# EAGLE schematic tarjeta_dspic33_proto_rev2 (EAGLE 4.16)

## Sheet 1 of 7
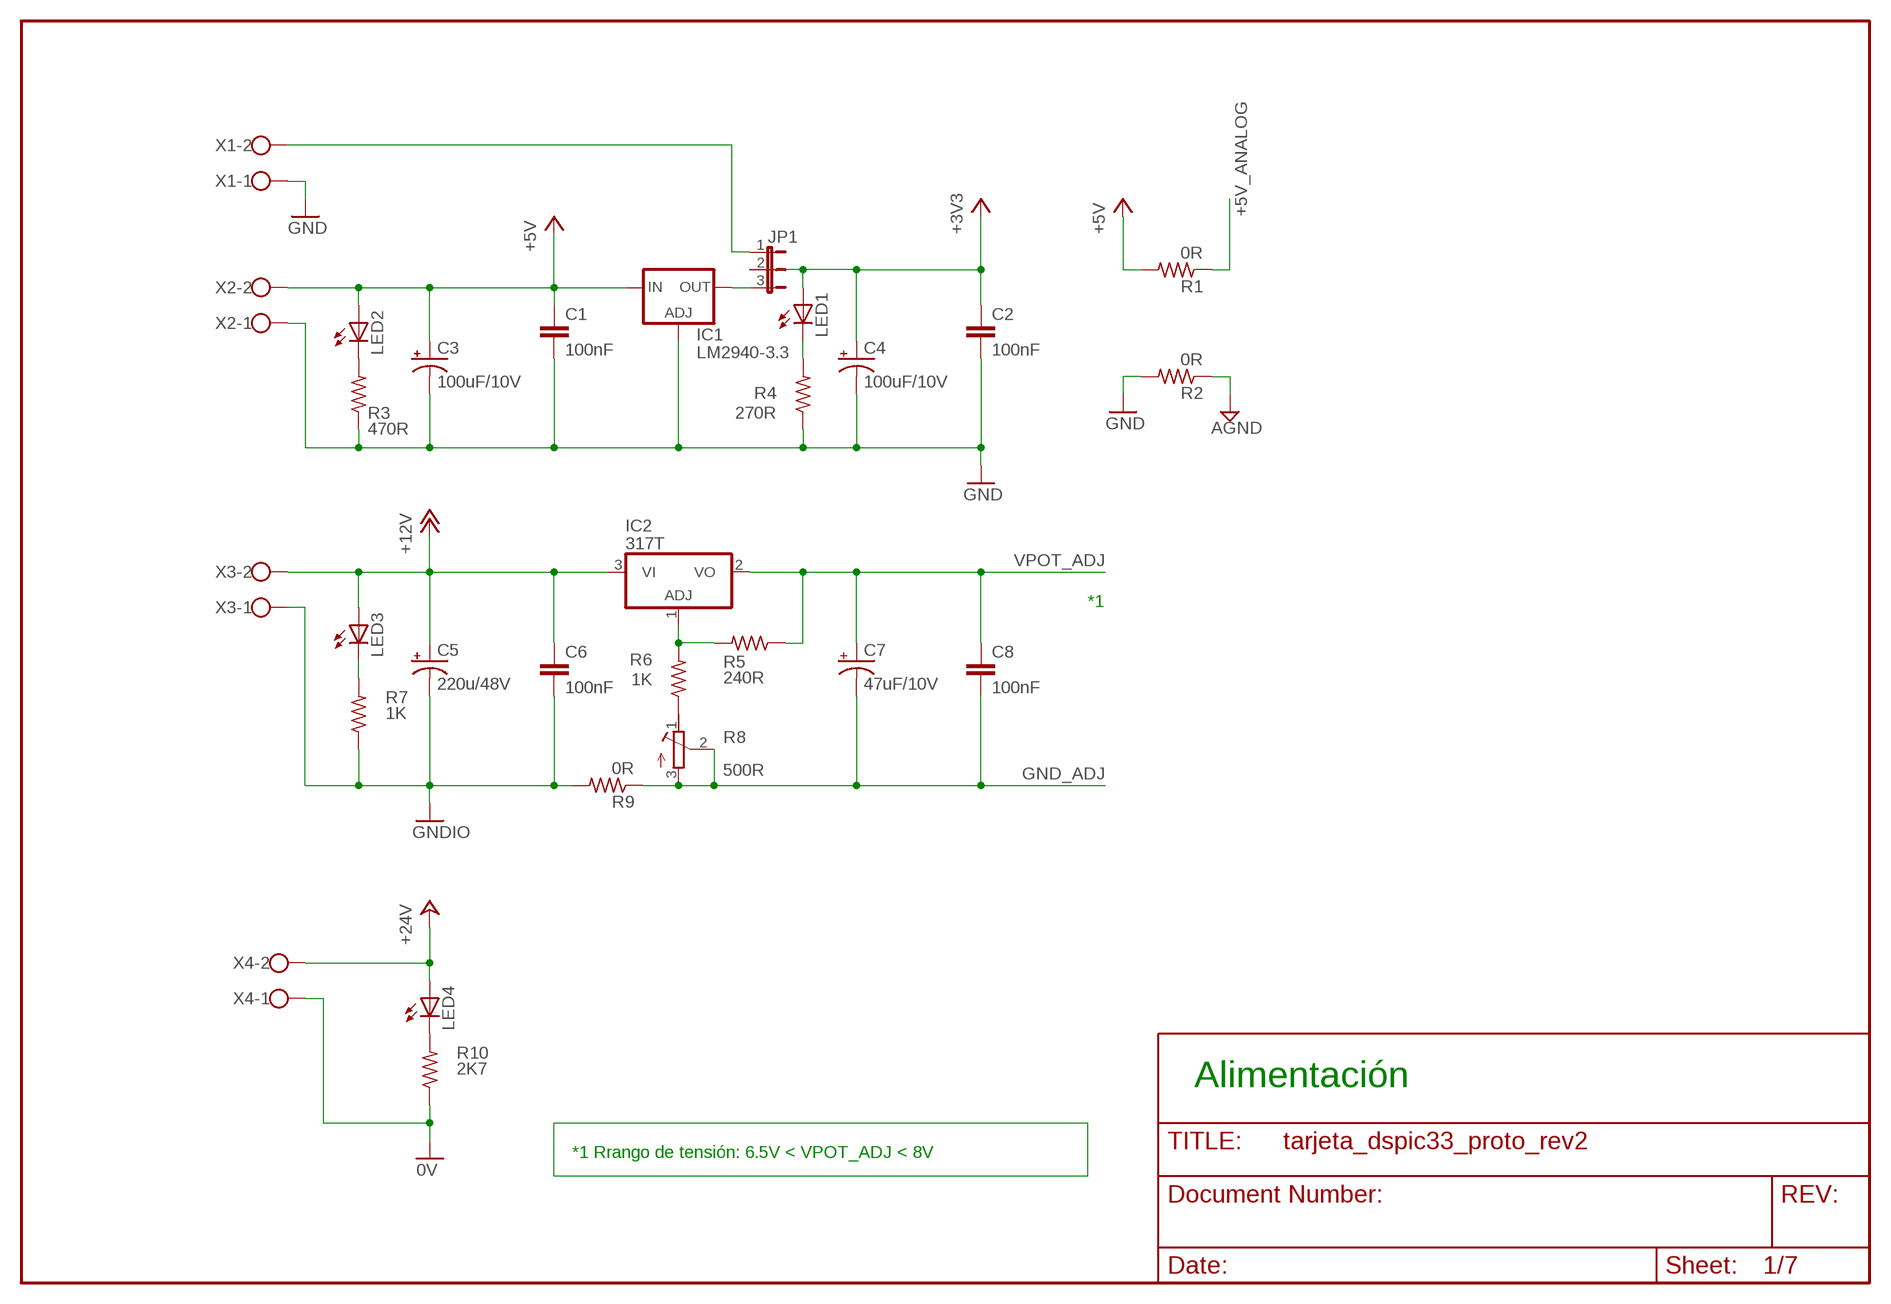
[diagram p0: schematic, sheet 1]

### Parts
C1  100nF  C-EU050-024X044  [C050-024X044]
C2  100nF  C-EU050-024X044  [C050-024X044]
C3  100uF/10V  CPOL-USE2-5  [E2-5]
C4  100uF/10V  CPOL-USE2-5  [E2-5]
C5  220u/48V  CPOL-USE2-5  [E2-5]
C6  100nF  C-EU050-024X044  [C050-024X044]
C7  47uF/10V  CPOL-USE2-5  [E2-5]
C8  100nF  C-EU050-024X044  [C050-024X044]
IC1  LM2940-3.3  LM317MABT  [TO220L1]
IC2  317T  [TO220H]
JP1  JP2E  [JP2]
LED1  LED3MM  [LED3MM]
LED2  LED3MM  [LED3MM]
LED3  LED3MM  [LED3MM]
LED4  LED3MM  [LED3MM]
R1  0R  R-US_0309/10  [0309/10]
R2  0R  R-US_0309/10  [0309/10]
R3  470R  R-US_0309/10  [0309/10]
R4  270R  R-US_0309/10  [0309/10]
R5  240R  R-US_0309/10  [0309/10]
R6  1K  R-US_0309/10  [0309/10]
R7  1K  R-US_0309/10  [0309/10]
R8  500R  R-TRIMMT93YA  [RTRIMT93YA]
R9  0R  R-US_0309/10  [0309/10]
R10  2K7  R-US_0309/10  [0309/10]
X1  W237-02P  [W237-132]
X2  W237-02P  [W237-132]
X3  W237-02P  [W237-132]
X4  W237-02P  [W237-132]

### Nets
0V: R10.1 X4.1 ; also sheet 2
+3V3: C2.1 C4.+ JP1.2 LED1.A ; also sheet 4,6,7
+5V: C1.1 C3.+ IC1.3(IN) LED2.A R1.2 X2.2 ; also sheet 2,3,4
+5V_ANALOG: R1.1 ; also sheet 2,5,7
+12V: C5.+ C6.1 IC2.3(VI) LED3.A X3.2 ; also sheet 3,4,5
+24V: LED4.A X4.2 ; also sheet 2
AGND: R2.1 ; also sheet 2,5,7
GND: C1.2 C2.2 C3.- C4.- IC1.1(ADJ) R2.2 R3.1 R4.1 X1.1 X2.1 ; also sheet 2,3,4,6,7
GND_ADJ: C7.- C8.2 R8.2(S) R8.3(E) R9.1 ; also sheet 3
GNDIO: C5.- C6.2 R7.1 R9.2 X3.1 ; also sheet 3,4,5
N$3: IC1.2(OUT) JP1.3
N$12: JP1.1 X1.2
N$17: R6.1 R8.1(A)
N$24: IC2.1(ADJ) R5.2 R6.2
N$64: LED2.K(C) R3.2
N$65: LED1.K(C) R4.2
N$66: LED3.K(C) R7.2
N$67: LED4.K(C) R10.2
VPOT_ADJ: C7.+ C8.1 IC2.2(VO) R5.1 ; also sheet 3

### Notes on the sheet
- *1
- Alimentación
- *1 Rrango de tensión: 6.5V < VPOT_ADJ < 8V

## Sheet 2 of 7
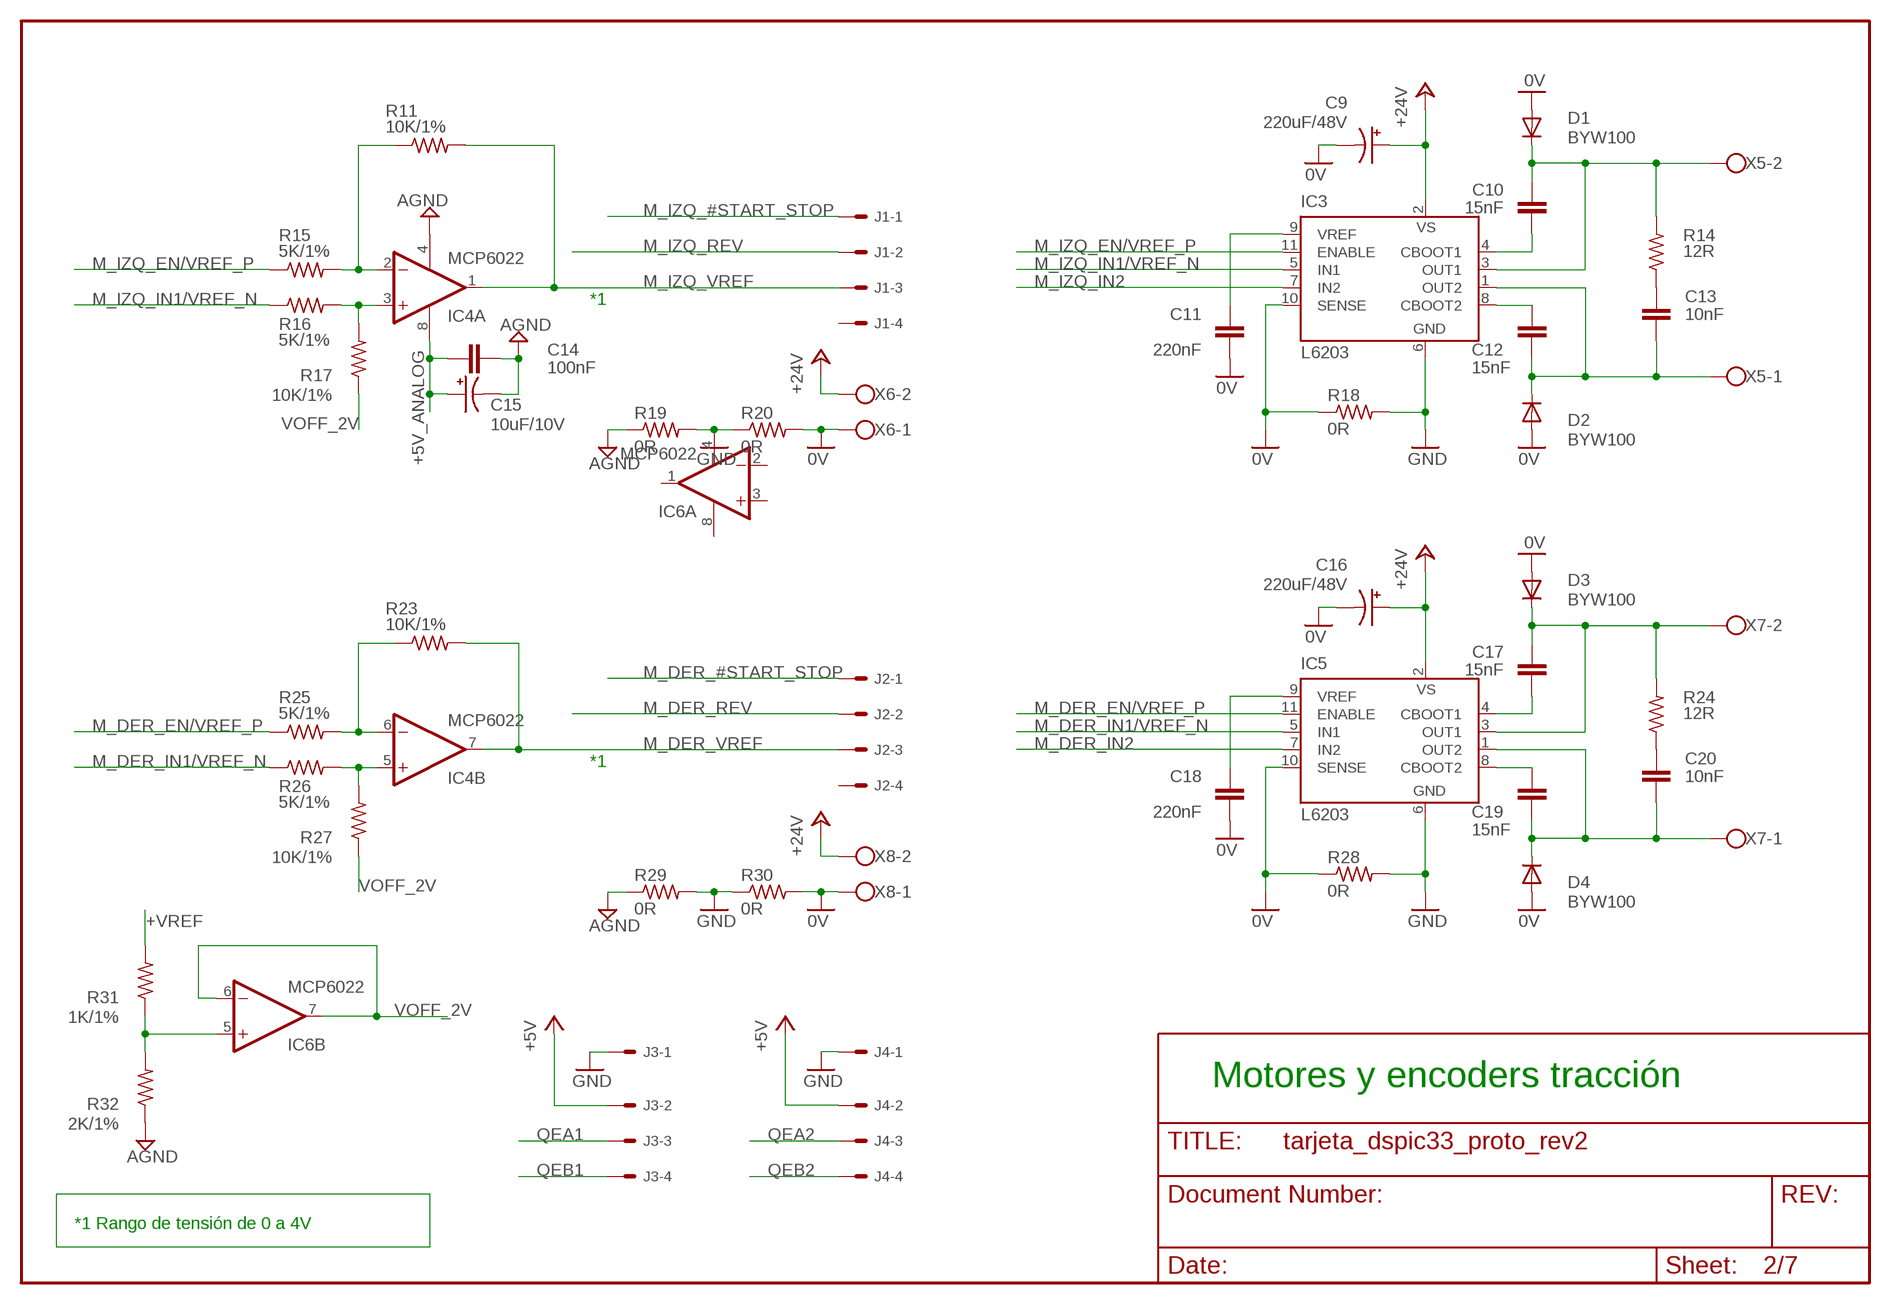
[diagram p1: schematic, sheet 2]

### Parts
C9  220uF/48V  CPOL-USE3.5-10  [E3,5-10]
C10  15nF  C-EU050-024X044  [C050-024X044]
C11  220nF  C-EU050-024X044  [C050-024X044]
C12  15nF  C-EU050-024X044  [C050-024X044]
C13  10nF  C-EU050-024X044  [C050-024X044]
C14  100nF  C-EU050-024X044  [C050-024X044]
C15  10uF/10V  CPOL-USE3.5-10  [E3,5-10]
C16  220uF/48V  CPOL-USE3.5-10  [E3,5-10]
C17  15nF  C-EU050-024X044  [C050-024X044]
C18  220nF  C-EU050-024X044  [C050-024X044]
C19  15nF  C-EU050-024X044  [C050-024X044]
C20  10nF  C-EU050-024X044  [C050-024X044]
D1  BYW100  [F126-10]
D2  BYW100  [F126-10]
D3  BYW100  [F126-10]
D4  BYW100  [F126-10]
IC3  L6203  [MULTIWATT-11]
IC4  MCP6022  OPA2344P  [DIL08]
IC5  L6203  [MULTIWATT-11]
IC6  MCP6022  OPA2344P  [DIL08]
J1  22-27-2041-04  [6410-04]
J2  22-27-2041-04  [6410-04]
J3  22-27-2041-04  [6410-04]
J4  22-27-2041-04  [6410-04]
R11  10K/1%  R-US_0309/10  [0309/10]
R14  12R  R-US_0309/10  [0309/10]
R15  5K/1%  R-US_0309/10  [0309/10]
R16  5K/1%  R-US_0309/10  [0309/10]
R17  10K/1%  R-US_0309/10  [0309/10]
R18  0R  R-US_0309/10  [0309/10]
R19  0R  R-US_0309/10  [0309/10]
R20  0R  R-US_0309/10  [0309/10]
R23  10K/1%  R-US_0309/10  [0309/10]
R24  12R  R-US_0309/10  [0309/10]
R25  5K/1%  R-US_0309/10  [0309/10]
R26  5K/1%  R-US_0309/10  [0309/10]
R27  10K/1%  R-US_0309/10  [0309/10]
R28  0R  R-US_0309/10  [0309/10]
R29  0R  R-US_0309/10  [0309/10]
R30  0R  R-US_0309/10  [0309/10]
R31  1K/1%  R-US_0309/10  [0309/10]
R32  2K/1%  R-US_0309/10  [0309/10]
X5  W237-02P  [W237-132]
X6  W237-02P  [W237-132]
X7  W237-02P  [W237-132]
X8  W237-02P  [W237-132]

### Nets
0V: C9.- C11.2 C16.- C18.2 D1.A D2.A D3.A D4.A IC3.10(SENSE) IC5.10(SENSE) R18.1 R20.2 R28.1 R30.2 X6.1 X8.1 ; also sheet 1
+5V: J3.2 J4.2 ; also sheet 1,3,4
+5V_ANALOG: C14.1 C15.+ IC4.8(A:V+) ; also sheet 1,5,7
+24V: C9.+ C16.+ IC3.2(VS) IC5.2(VS) X6.2 X8.2 ; also sheet 1
+VREF: R31.2 ; also sheet 5,7
AGND: C14.2 C15.- IC4.4(A:V-) R19.1 R29.1 R32.1 ; also sheet 1,5,7
GND: IC3.6(GND) IC5.6(GND) J3.1 J4.1 R18.2 R19.2 R20.1 R28.2 R29.2 R30.1 ; also sheet 1,3,4,6,7
M_DER_#START_STOP: J2.1 ; also sheet 7
M_DER_EN/VREF_P: IC5.11(ENABLE) R25.1 ; also sheet 7
M_DER_IN1/VREF_N: IC5.5(IN1) R26.1 ; also sheet 7
M_DER_IN2: IC5.7(IN2) ; also sheet 7
M_DER_REV: J2.2 ; also sheet 7
M_DER_VREF: IC4.7(B:OUT) J2.3 R23.2
M_IZQ_#START_STOP: J1.1 ; also sheet 7
M_IZQ_EN/VREF_P: IC3.11(ENABLE) R15.1 ; also sheet 7
M_IZQ_IN1/VREF_N: IC3.5(IN1) R16.1 ; also sheet 7
M_IZQ_IN2: IC3.7(IN2) ; also sheet 7
M_IZQ_REV: J1.2 ; also sheet 7
M_IZQ_VREF: IC4.1(A:OUT) J1.3 R11.2
N$4: C11.1 IC3.9(VREF)
N$6: IC6.5(B:+IN) R31.1 R32.2
N$7: C12.1 IC3.8(CBOOT2)
N$8: C10.1 IC3.4(CBOOT1)
N$9: C10.2 D1.C IC3.3(OUT1) R14.2 X5.2
N$10: C13.2 R14.1
N$11: C12.2 C13.1 D2.C IC3.1(OUT2) X5.1
N$14: IC4.2(A:-IN) R11.1 R15.2
N$15: C18.1 IC5.9(VREF)
N$18: C19.1 IC5.8(CBOOT2)
N$19: C17.1 IC5.4(CBOOT1)
N$20: C20.2 R24.1
N$21: C17.2 D3.C IC5.3(OUT1) R24.2 X7.2
N$22: C19.2 C20.1 D4.C IC5.1(OUT2) X7.1
N$25: IC4.3(A:+IN) R16.2 R17.2
N$28: IC4.6(B:-IN) R23.1 R25.2
N$29: IC4.5(B:+IN) R26.2 R27.2
QEA1: J3.3 ; also sheet 7
QEA2: J4.3 ; also sheet 7
QEB1: J3.4 ; also sheet 7
QEB2: J4.4 ; also sheet 7
VOFF_2V: IC6.6(B:-IN) IC6.7(B:OUT) R17.1 R27.1
Unconnected: J1.4 J2.4

### Notes on the sheet
- *1
- *1
- Motores y encoders tracción
- *1 Rango de tensión de 0 a 4V

## Sheet 3 of 7
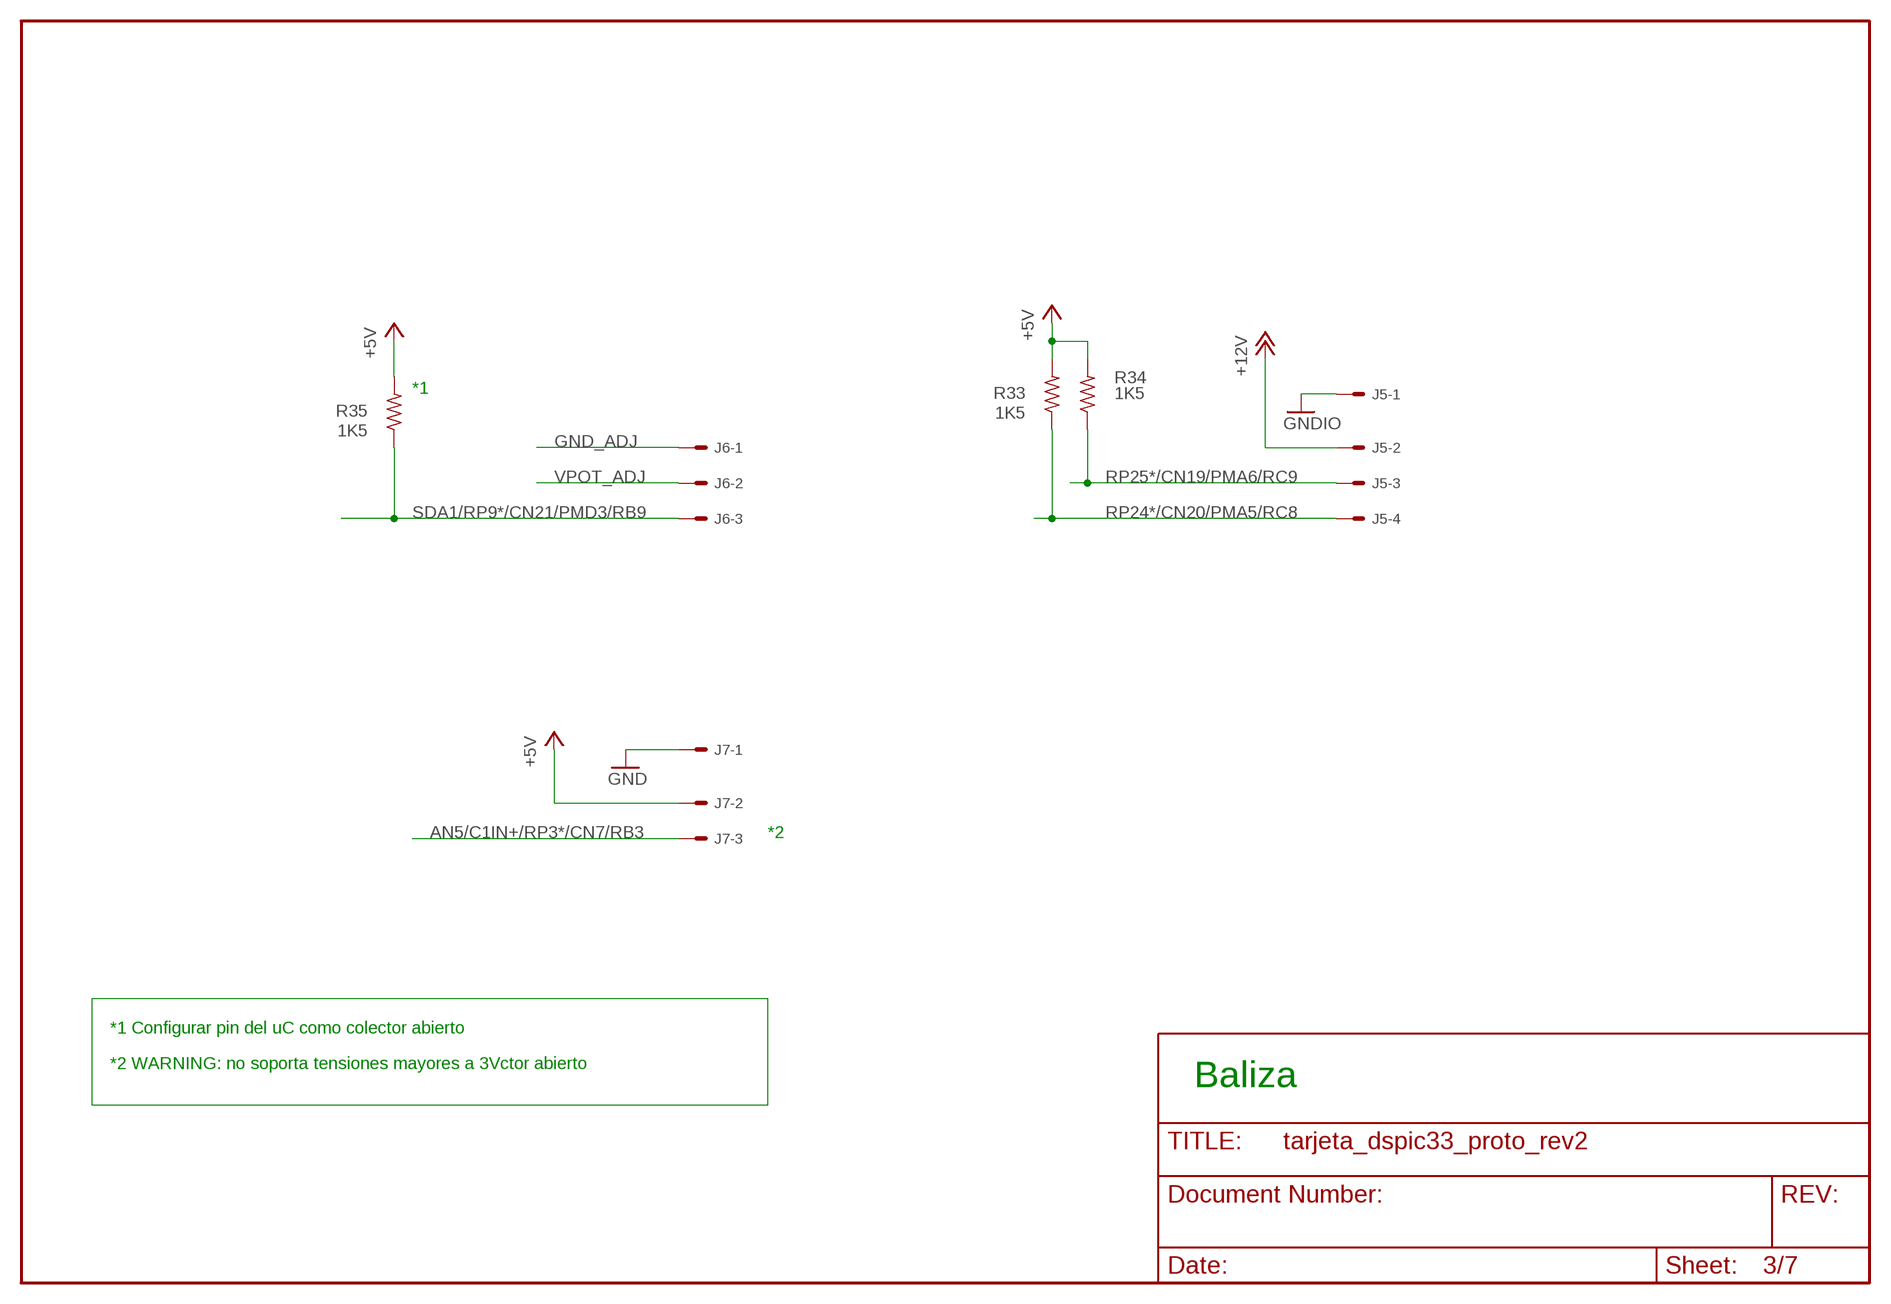
[diagram p2: schematic, sheet 3]

### Parts
J5  22-27-2041-04  [6410-04]
J6  22-27-2031-03  [6410-03]
J7  22-27-2031-03  [6410-03]
R33  1K5  R-US_0207/7  [0207/7]
R34  1K5  R-US_0207/7  [0207/7]
R35  1K5  R-US_0207/7  [0207/7]

### Nets
+5V: J7.2 R33.2 R34.2 R35.2 ; also sheet 1,2,4
+12V: J5.2 ; also sheet 1,4,5
AN5/C1IN+/RP3*/CN7/RB3: J7.3 ; also sheet 7
GND: J7.1 ; also sheet 1,2,4,6,7
GND_ADJ: J6.1 ; also sheet 1
GNDIO: J5.1 ; also sheet 1,4,5
RP24*/CN20/PMA5/RC8: J5.4 R33.1 ; also sheet 7
RP25*/CN19/PMA6/RC9: J5.3 R34.1 ; also sheet 7
SDA1/RP9*/CN21/PMD3/RB9: J6.3 R35.1 ; also sheet 7
VPOT_ADJ: J6.2 ; also sheet 1

### Notes on the sheet
- *1
- *2
- *1 Configurar pin del uC como colector abierto
- *2 WARNING: no soporta tensiones mayores a 3Vctor abierto
- Baliza

## Sheet 4 of 7
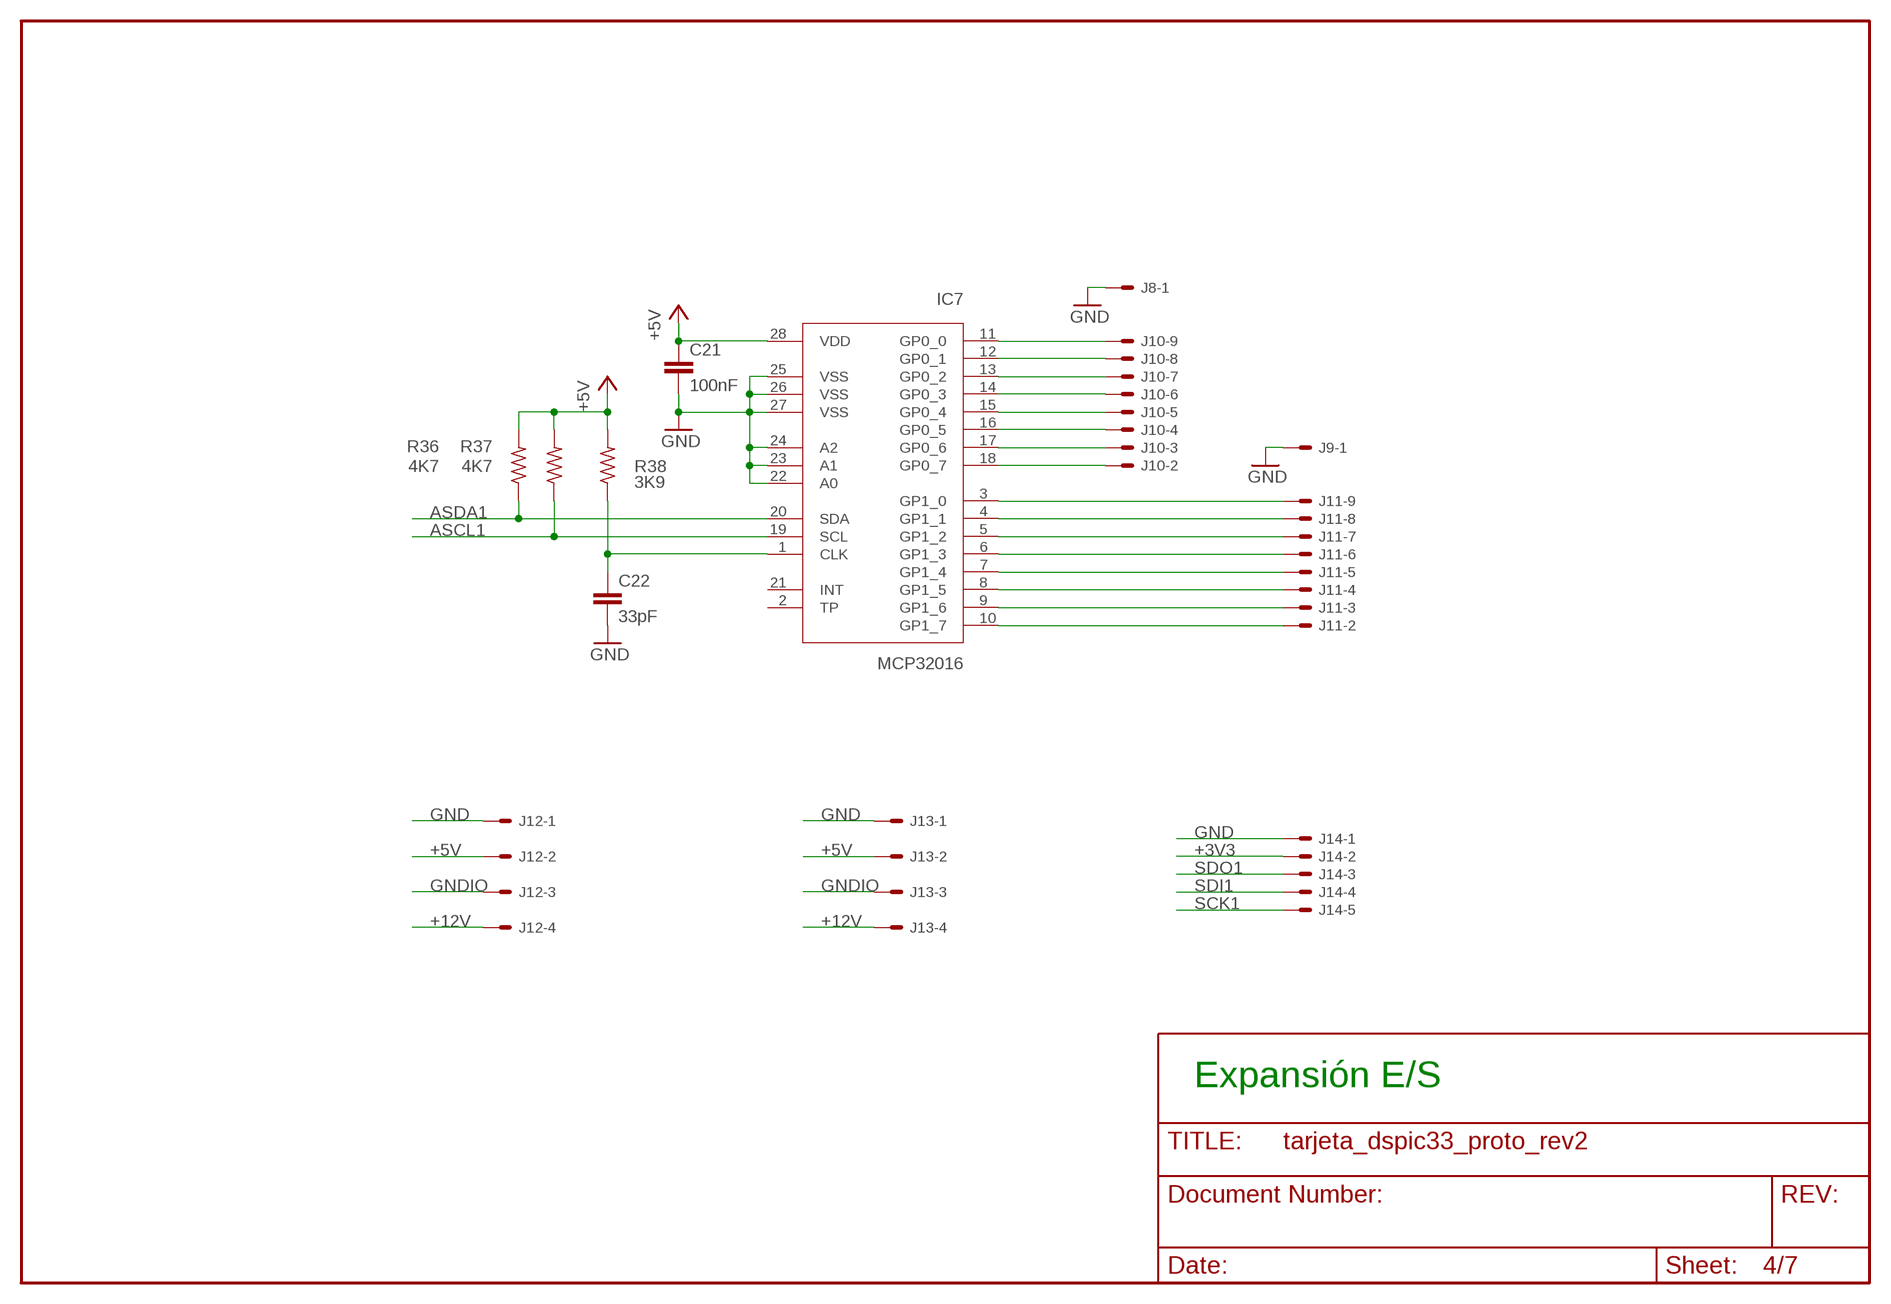
[diagram p3: schematic, sheet 4]

### Parts
C21  100nF  C-EU050-024X044  [C050-024X044]
C22  33pF  C-EU050-024X044  [C050-024X044]
IC7  MCP32016  [DIL28-3]
J8  22-27-2091-09  [6410-09]
J9  22-27-2091-09  [6410-09]
J10  22-27-2091-09  [6410-09]
J11  22-27-2091-09  [6410-09]
J12  22-27-2041-04  [6410-04]
J13  22-27-2041-04  [6410-04]
J14  22-27-2051-05  [6410-05]
R36  4K7  R-US_0207/7  [0207/7]
R37  4K7  R-US_0207/7  [0207/7]
R38  3K9  R-US_0207/7  [0207/7]

### Nets
+3V3: J14.2 ; also sheet 1,6,7
+5V: C21.1 IC7.28(VDD) J12.2 J13.2 R36.2 R37.2 R38.2 ; also sheet 1,2,3
+12V: J12.4 J13.4 ; also sheet 1,3,5
ASCL1: IC7.19(SCL) R37.1 ; also sheet 7
ASDA1: IC7.20(SDA) R36.1 ; also sheet 7
GND: C21.2 C22.2 IC7.22(A0) IC7.23(A1) IC7.24(A2) IC7.25(VSS) IC7.26(VSS) IC7.27(VSS) J8.1 J9.1 J12.1 J13.1 J14.1 ; also sheet 1,2,3,6,7
GNDIO: J12.3 J13.3 ; also sheet 1,3,5
N$26: C22.1 IC7.1(CLK) R38.1
N$35: IC7.7(GP1_4) J11.5
N$41: IC7.3(GP1_0) J11.9
N$42: IC7.11(GP0_0) J10.9
N$43: IC7.12(GP0_1) J10.8
N$44: IC7.13(GP0_2) J10.7
N$45: IC7.14(GP0_3) J10.6
N$46: IC7.15(GP0_4) J10.5
N$47: IC7.16(GP0_5) J10.4
N$48: IC7.17(GP0_6) J10.3
N$49: IC7.18(GP0_7) J10.2
N$50: IC7.4(GP1_1) J11.8
N$51: IC7.5(GP1_2) J11.7
N$52: IC7.6(GP1_3) J11.6
N$53: IC7.8(GP1_5) J11.4
N$54: IC7.9(GP1_6) J11.3
N$55: IC7.10(GP1_7) J11.2
SCK1: J14.5 ; also sheet 7
SDI1: J14.4 ; also sheet 7
SDO1: J14.3 ; also sheet 7
Unconnected: IC7.2(TP) IC7.21(INT) J8.2 J8.3 J8.4 J8.5 J8.6 J8.7 J8.8 J8.9 J9.2 J9.3 J9.4 J9.5 J9.6 J9.7 J9.8 J9.9 J10.1 J11.1

### Notes on the sheet
- Expansión E/S

## Sheet 5 of 7
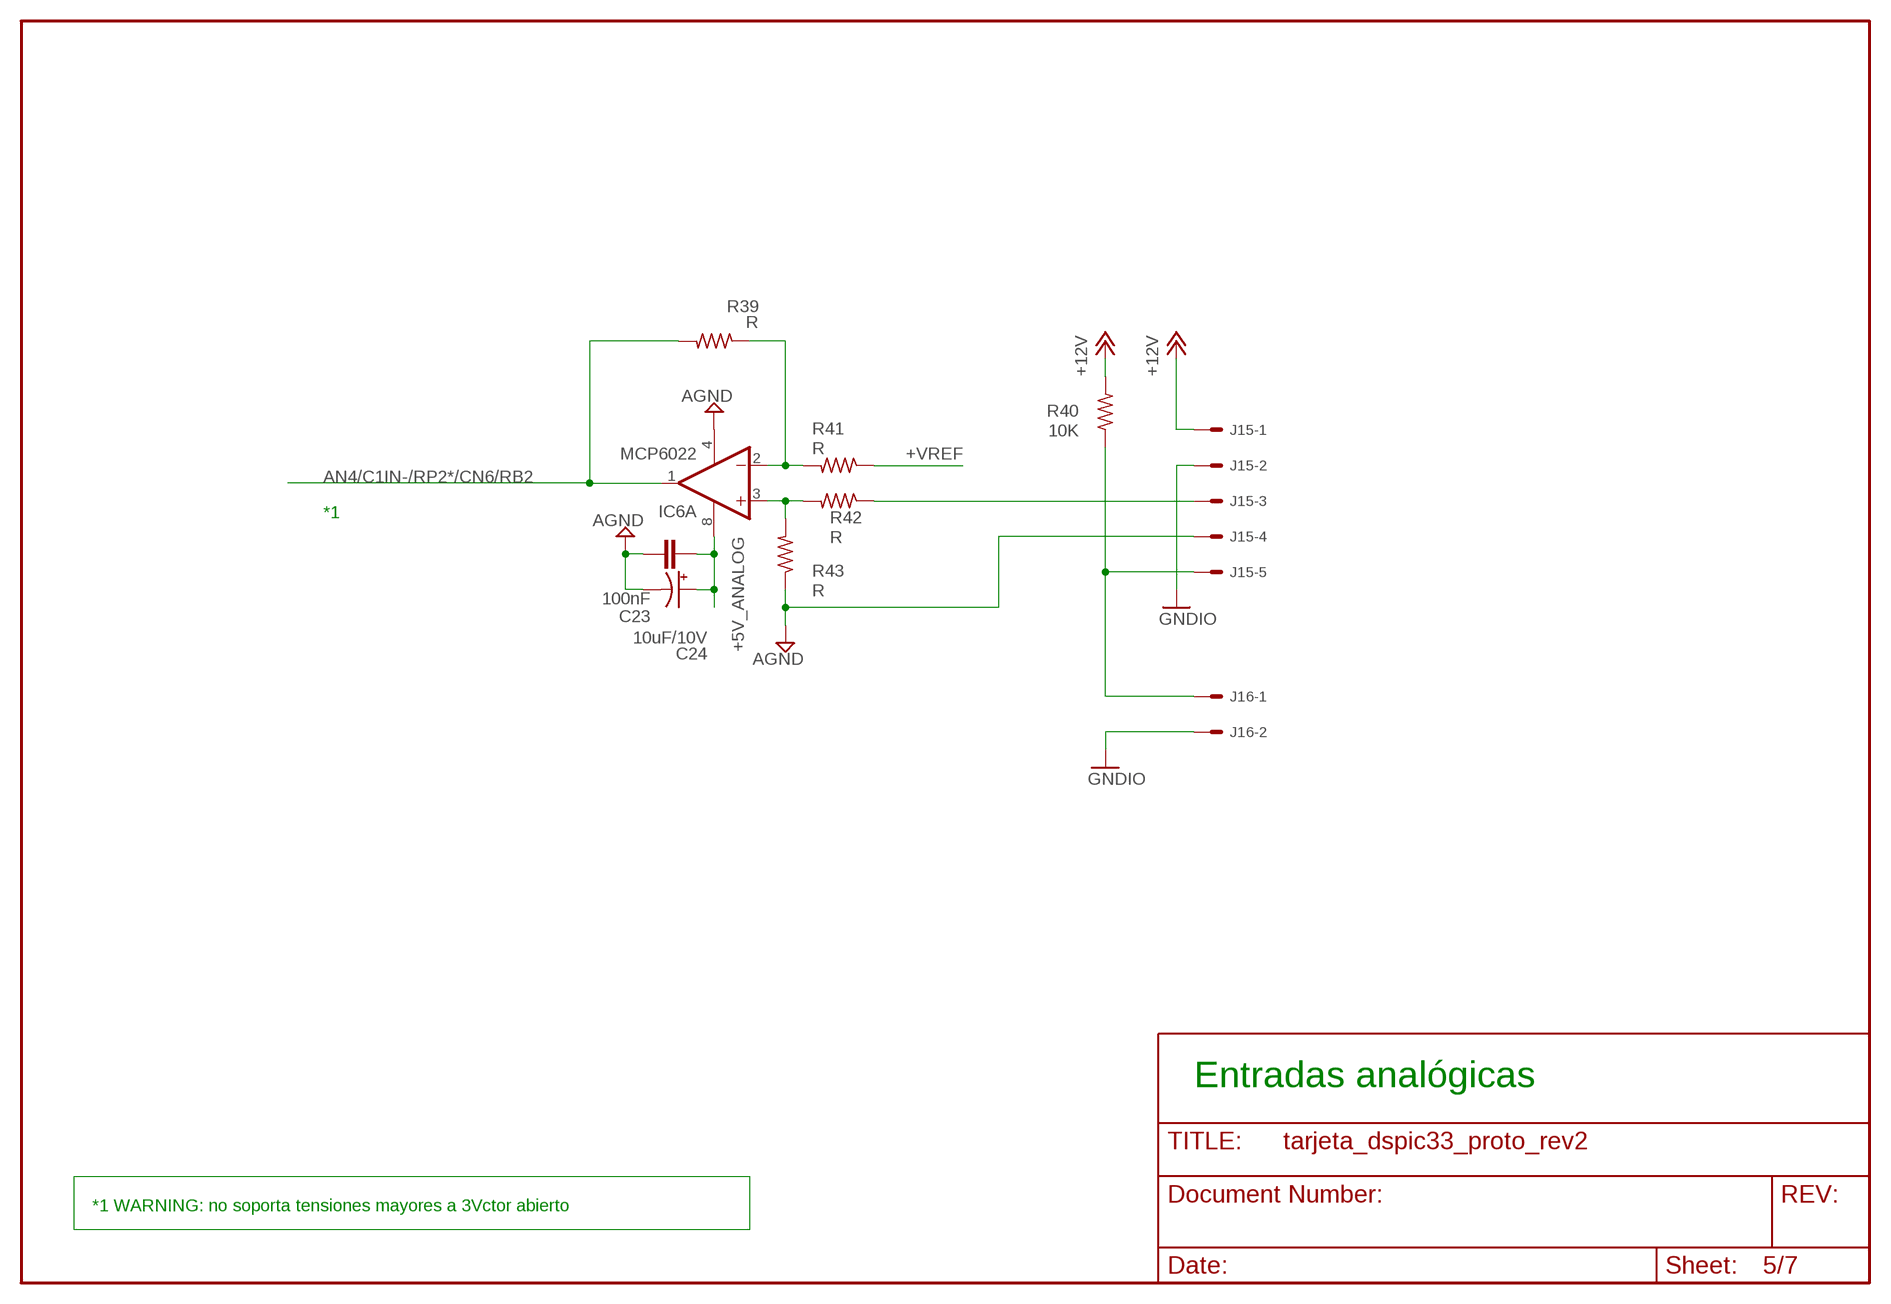
[diagram p4: schematic, sheet 5]

### Parts
C23  100nF  C-EU050-024X044  [C050-024X044]
C24  10uF/10V  CPOL-USE3.5-10  [E3,5-10]
J15  22-27-2051-05  [6410-05]
J16  22-27-2021-02  [6410-02]
R39  R  R-US_0309/10  [0309/10]
R40  10K  R-US_0207/7  [0207/7]
R41  R  R-US_0309/10  [0309/10]
R42  R  R-US_0309/10  [0309/10]
R43  R  R-US_0309/10  [0309/10]

### Nets
+5V_ANALOG: C23.1 C24.+ IC6.8(A:V+) ; also sheet 1,2,7
+12V: J15.1 R40.2 ; also sheet 1,3,4
+VREF: R41.1 ; also sheet 2,7
AGND: C23.2 C24.- IC6.4(A:V-) J15.4 R43.1 ; also sheet 1,2,7
AN4/C1IN-/RP2*/CN6/RB2: IC6.1(A:OUT) R39.2 ; also sheet 7
GNDIO: J15.2 J16.2 ; also sheet 1,3,4
N$5: J15.3 R42.1
N$36: IC6.2(A:-IN) R39.1 R41.2
N$39: J15.5 J16.1 R40.1
N$40: IC6.3(A:+IN) R42.2 R43.2

### Notes on the sheet
- *1
- Entradas analógicas
- *1 WARNING: no soporta tensiones mayores a 3Vctor abierto

## Sheet 6 of 7
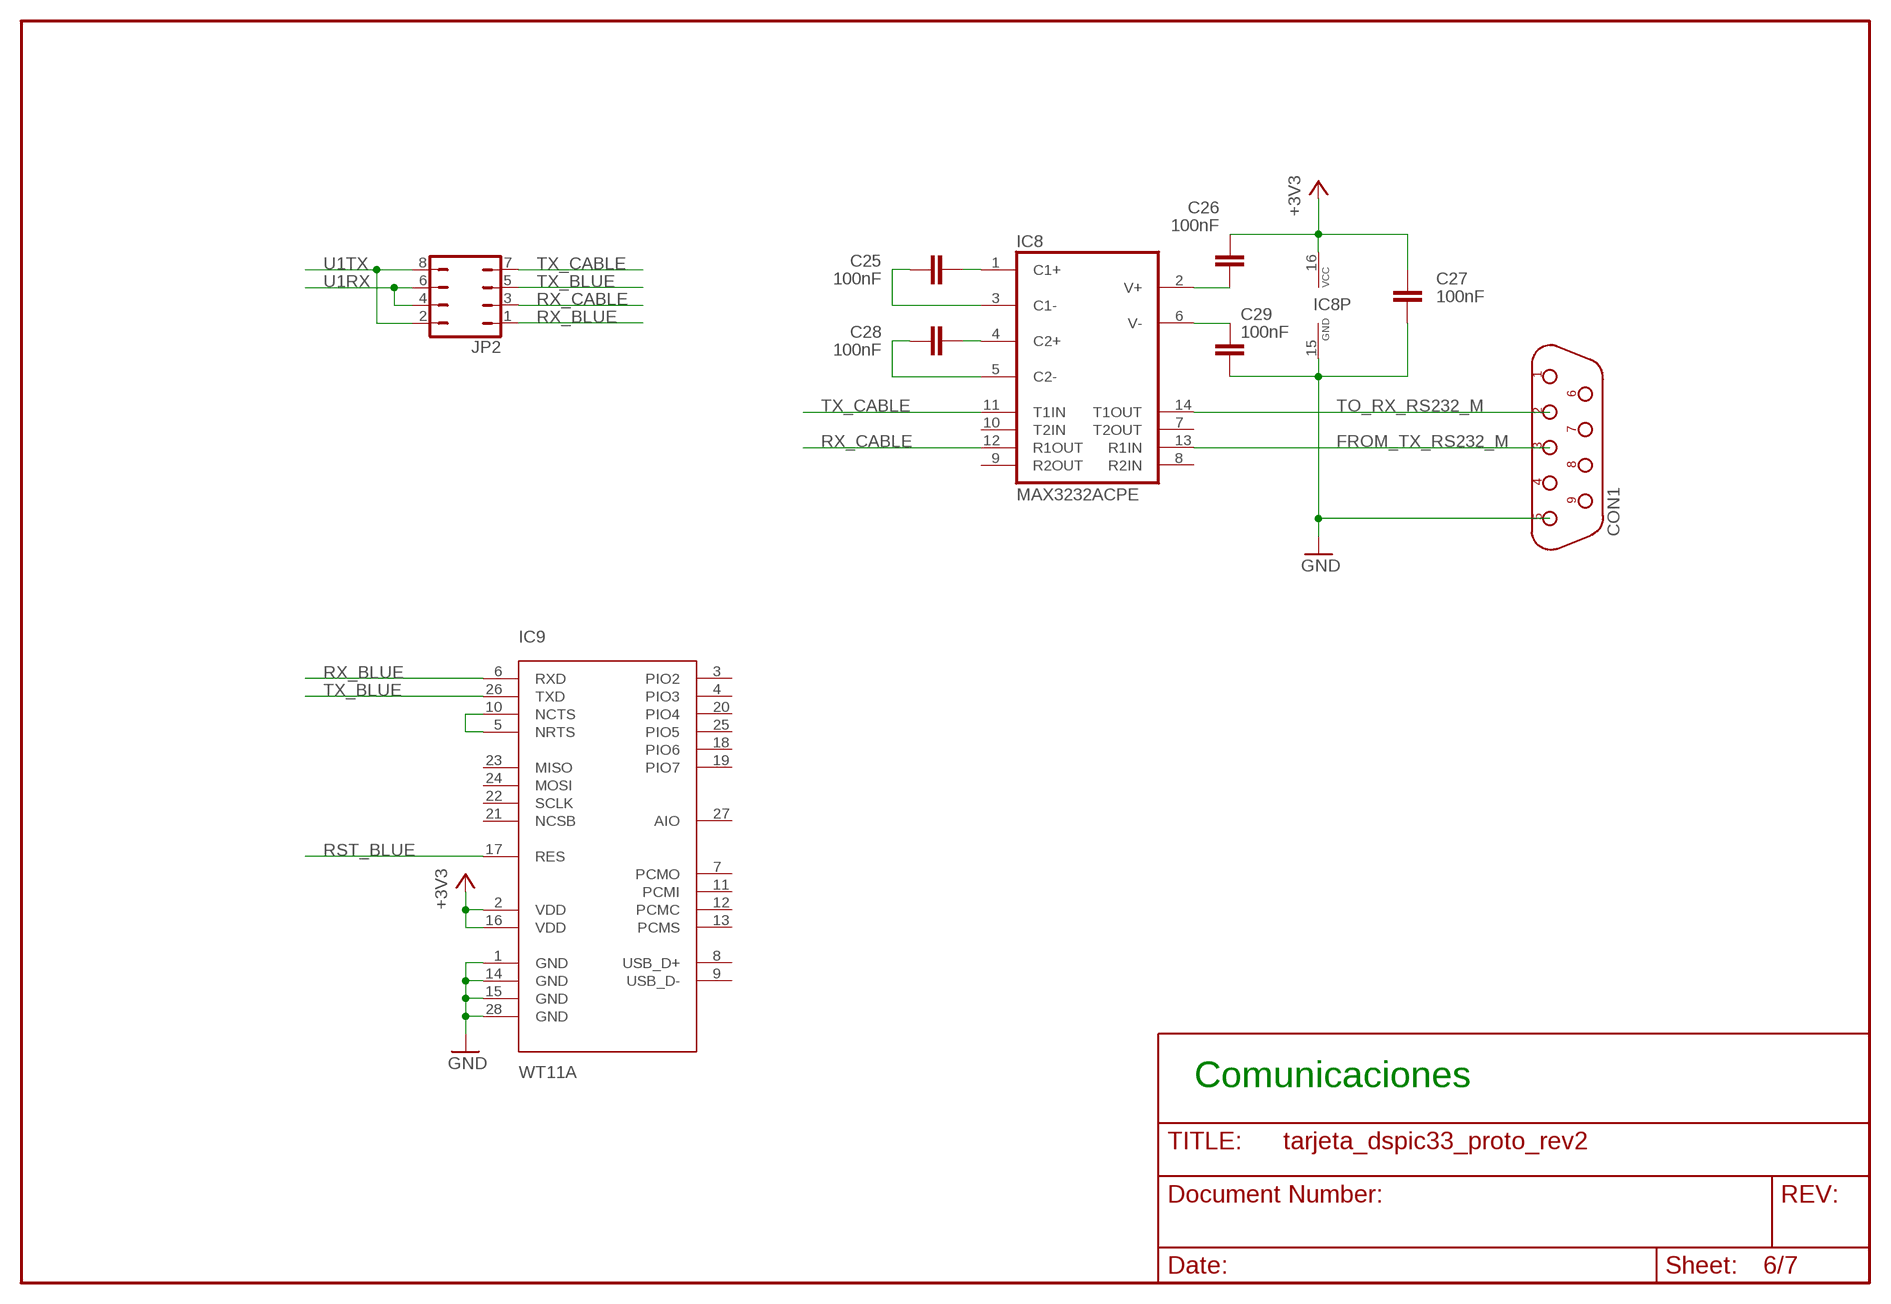
[diagram p5: schematic, sheet 6]

### Parts
C25  100nF  C-EU050-024X044  [C050-024X044]
C26  100nF  C-EU050-024X044  [C050-024X044]
C27  100nF  C-EU050-024X044  [C050-024X044]
C28  100nF  C-EU050-024X044  [C050-024X044]
C29  100nF  C-EU050-024X044  [C050-024X044]
CON1  DB9F/90  [D-09F/90]
IC8  MAX3232ACPE  MAX232ACPE  [DIL16]
IC9  WT11A  [WT11]
JP2  JP4Q  [JP4Q]

### Nets
+3V3: C26.2 C27.2 IC8.16(VCC) IC9.2(VDD) IC9.16(VDD) ; also sheet 1,4,7
FROM_TX_RS232_M: CON1.3 IC8.13(R1IN)
GND: C27.1 C29.1 CON1.5 IC8.15(GND) IC9.1(GND) IC9.14(GND) IC9.15(GND) IC9.28(GND) ; also sheet 1,2,3,4,7
N$16: IC9.5(NRTS) IC9.10(NCTS)
N$27: C25.2 IC8.1(C1+)
N$30: C25.1 IC8.3(C1-)
N$31: C28.2 IC8.4(C2+)
N$32: C28.1 IC8.5(C2-)
N$33: C26.1 IC8.2(V+)
N$34: C29.2 IC8.6(V-)
RST_BLUE: IC9.17(RES) ; also sheet 7
RX_BLUE: IC9.6(RXD) JP2.1
RX_CABLE: IC8.12(R1OUT) JP2.3
TO_RX_RS232_M: CON1.2 IC8.14(T1OUT)
TX_BLUE: IC9.26(TXD) JP2.5
TX_CABLE: IC8.11(T1IN) JP2.7
U1RX: JP2.4 JP2.6 ; also sheet 7
U1TX: JP2.2 JP2.8 ; also sheet 7
Unconnected: CON1.1 CON1.4 CON1.6 CON1.7 CON1.8 CON1.9 IC8.7(T2OUT) IC8.8(R2IN) IC8.9(R2OUT) IC8.10(T2IN) IC9.3(PIO2) IC9.4(PIO3) IC9.7(PCMO) IC9.8(USB_D+) IC9.9(USB_D-) IC9.11(PCMI) IC9.12(PCMC) IC9.13(PCMS) IC9.18(PIO6) IC9.19(PIO7) IC9.20(PIO4) IC9.21(NCSB) IC9.22(SCLK) IC9.23(MISO) IC9.24(MOSI) IC9.25(PIO5) IC9.27(AIO)

### Notes on the sheet
- Comunicaciones

## Sheet 7 of 7
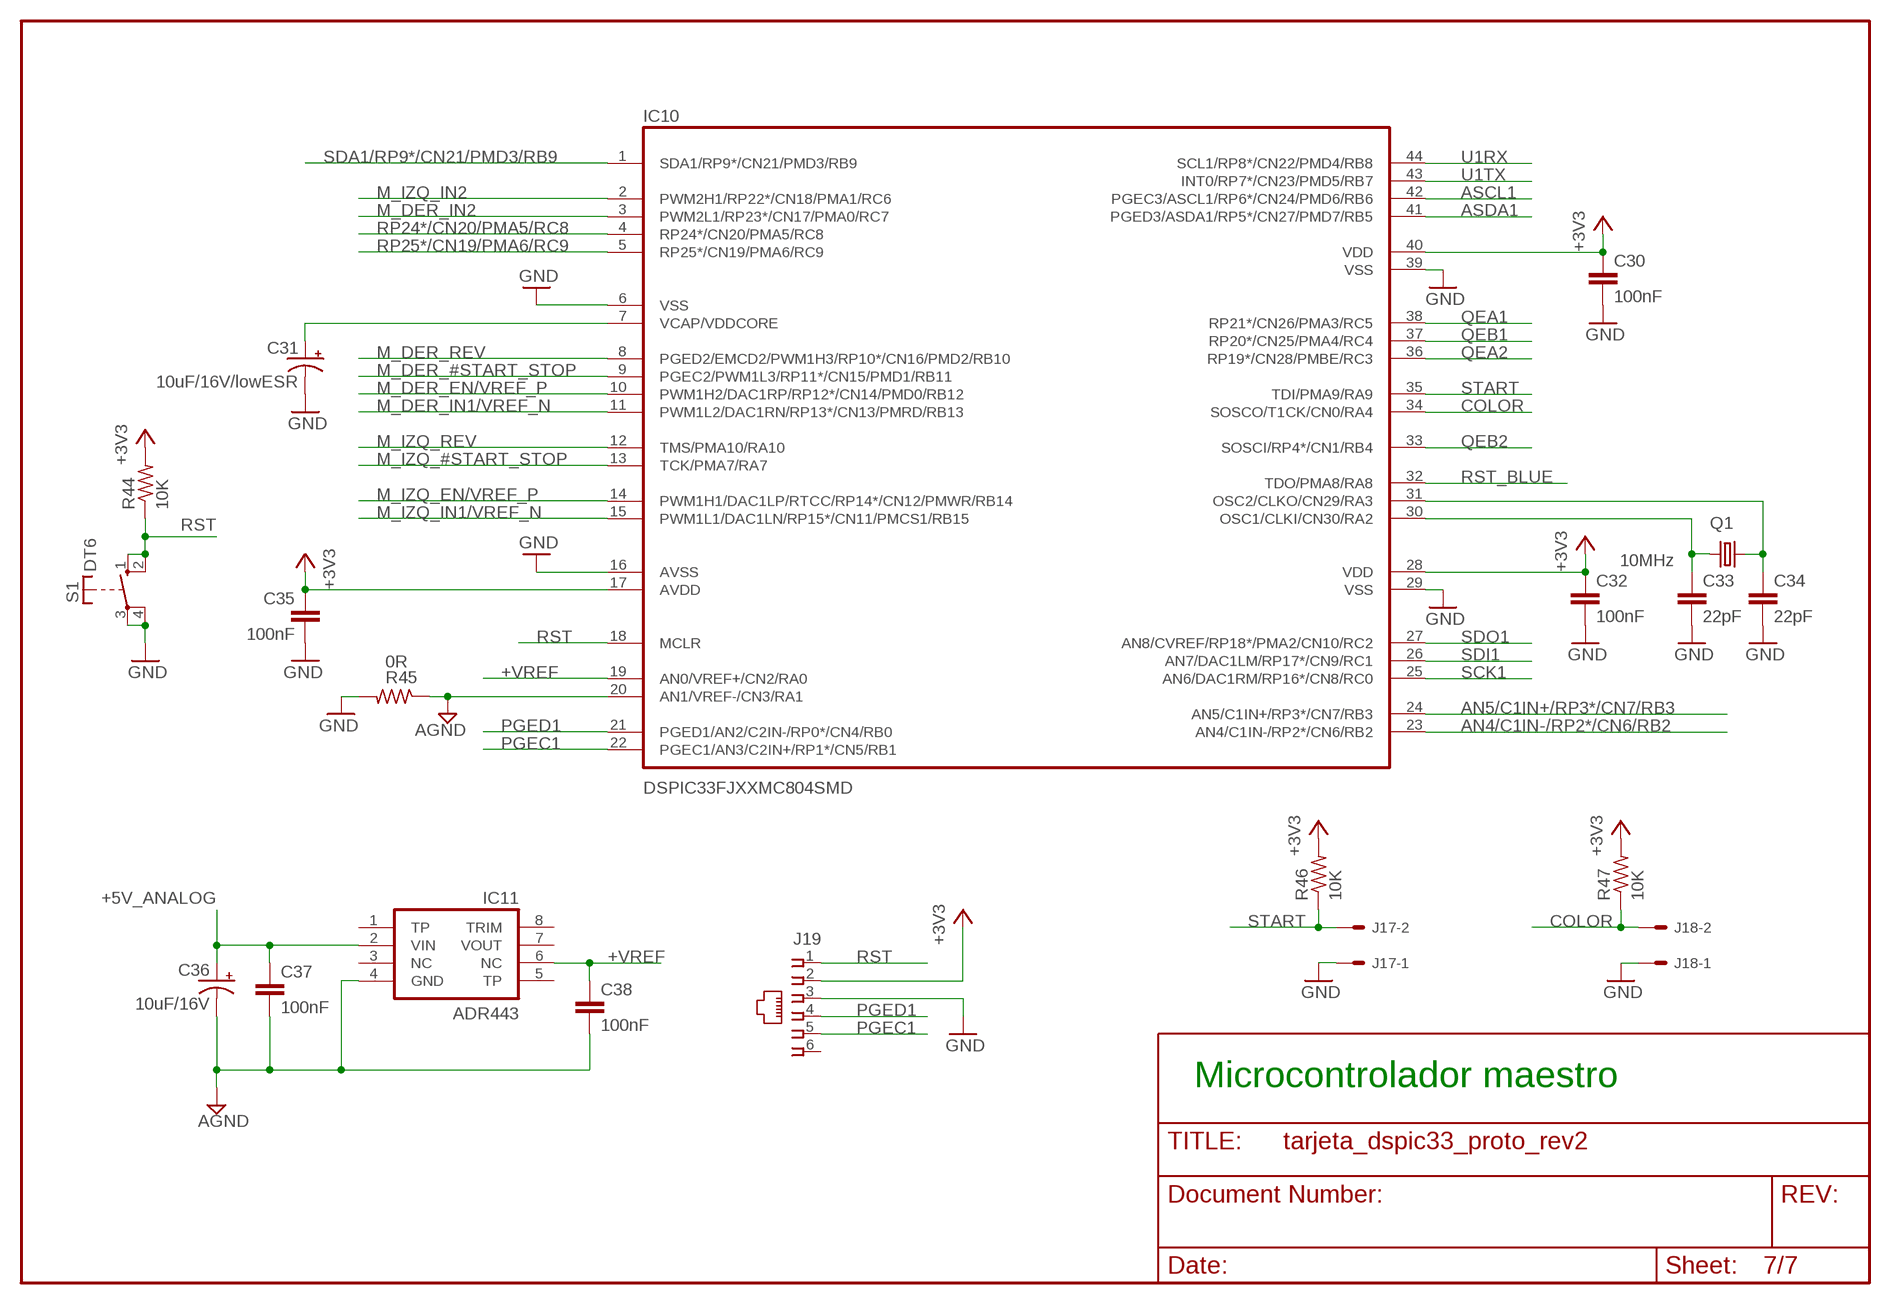
[diagram p6: schematic, sheet 7]

### Parts
C30  100nF  C-EU050-024X044  [C050-024X044]
C31  10uF/16V/lowESR  CPOL-USE3.5-8  [E3,5-8]
C32  100nF  C-EU050-024X044  [C050-024X044]
C33  22pF  C-EU050-024X044  [C050-024X044]
C34  22pF  C-EU050-024X044  [C050-024X044]
C35  100nF  C-EU050-024X044  [C050-024X044]
C36  10uF/16V  CPOL-USE3.5-8  [E3,5-8]
C37  100nF  C-EU050-024X044  [C050-024X044]
C38  100nF  C-EU050-024X044  [C050-024X044]
IC10  DSPIC33FJXXMC804SMD  [TQFP44]
IC11  ADR443  [SOIC8]
J17  22-27-2021-02  [6410-02]
J18  22-27-2021-02  [6410-02]
J19  520470-3  [520470-3]
Q1  10MHz  CRYSTALHC49U-H  [HC49U-H]
R44  10K  R-US_0204/7  [0204/7]
R45  0R  R-US_0207/7  [0207/7]
R46  10K  R-US_0207/7  [0207/7]
R47  10K  R-US_0207/7  [0207/7]
S1  DT6  [DT6]

### Nets
+3V3: C30.1 C32.1 C35.1 IC10.17(AVDD) IC10.28(VDD) IC10.40(VDD) J19.2 R44.2 R46.2 R47.2 ; also sheet 1,4,6
+5V_ANALOG: C36.+ C37.1 IC11.2(VIN) ; also sheet 1,2,5
+VREF: C38.1 IC10.19(AN0/VREF+/CN2/RA0) IC11.6(NC) ; also sheet 2,5
AGND: C36.- C37.2 C38.2 IC10.20(AN1/VREF-/CN3/RA1) IC11.4(GND) R45.1 ; also sheet 1,2,5
AN4/C1IN-/RP2*/CN6/RB2: IC10.23(AN4/C1IN-/RP2*/CN6/RB2) ; also sheet 5
AN5/C1IN+/RP3*/CN7/RB3: IC10.24(AN5/C1IN+/RP3*/CN7/RB3) ; also sheet 3
ASCL1: IC10.42(PGEC3/ASCL1/RP6*/CN24/PMD6/RB6) ; also sheet 4
ASDA1: IC10.41(PGED3/ASDA1/RP5*/CN27/PMD7/RB5) ; also sheet 4
COLOR: IC10.34(SOSCO/T1CK/CN0/RA4) J18.2 R47.1
GND: C30.2 C31.- C32.2 C33.2 C34.2 C35.2 IC10.6(VSS) IC10.16(AVSS) IC10.29(VSS) IC10.39(VSS) J17.1 J18.1 J19.3 R45.2 S1.3(P) S1.4(P) ; also sheet 1,2,3,4,6
M_DER_#START_STOP: IC10.9(PGEC2/PWM1L3/RP11*/CN15/PMD1/RB11) ; also sheet 2
M_DER_EN/VREF_P: IC10.10(PWM1H2/DAC1RP/RP12*/CN14/PMD0/RB12) ; also sheet 2
M_DER_IN1/VREF_N: IC10.11(PWM1L2/DAC1RN/RP13*/CN13/PMRD/RB13) ; also sheet 2
M_DER_IN2: IC10.3(PWM2L1/RP23*/CN17/PMA0/RC7) ; also sheet 2
M_DER_REV: IC10.8(PGED2/EMCD2/PWM1H3/RP10*/CN16/PMD2/RB10) ; also sheet 2
M_IZQ_#START_STOP: IC10.13(TCK/PMA7/RA7) ; also sheet 2
M_IZQ_EN/VREF_P: IC10.14(PWM1H1/DAC1LP/RTCC/RP14*/CN12/PMWR/RB14) ; also sheet 2
M_IZQ_IN1/VREF_N: IC10.15(PWM1L1/DAC1LN/RP15*/CN11/PMCS1/RB15) ; also sheet 2
M_IZQ_IN2: IC10.2(PWM2H1/RP22*/CN18/PMA1/RC6) ; also sheet 2
M_IZQ_REV: IC10.12(TMS/PMA10/RA10) ; also sheet 2
N$1: C31.+ IC10.7(VCAP/VDDCORE)
N$2: C34.1 IC10.31(OSC2/CLKO/CN29/RA3) Q1.2
N$13: C33.1 IC10.30(OSC1/CLKI/CN30/RA2) Q1.1
PGEC1: IC10.22(PGEC1/AN3/C2IN+/RP1*/CN5/RB1) J19.5
PGED1: IC10.21(PGED1/AN2/C2IN-/RP0*/CN4/RB0) J19.4
QEA1: IC10.38(RP21*/CN26/PMA3/RC5) ; also sheet 2
QEA2: IC10.36(RP19*/CN28/PMBE/RC3) ; also sheet 2
QEB1: IC10.37(RP20*/CN25/PMA4/RC4) ; also sheet 2
QEB2: IC10.33(SOSCI/RP4*/CN1/RB4) ; also sheet 2
RP24*/CN20/PMA5/RC8: IC10.4(RP24*/CN20/PMA5/RC8) ; also sheet 3
RP25*/CN19/PMA6/RC9: IC10.5(RP25*/CN19/PMA6/RC9) ; also sheet 3
RST: IC10.18(MCLR) J19.1 R44.1 S1.1(S) S1.2(S)
RST_BLUE: IC10.32(TDO/PMA8/RA8) ; also sheet 6
SCK1: IC10.25(AN6/DAC1RM/RP16*/CN8/RC0) ; also sheet 4
SDA1/RP9*/CN21/PMD3/RB9: IC10.1(SDA1/RP9*/CN21/PMD3/RB9) ; also sheet 3
SDI1: IC10.26(AN7/DAC1LM/RP17*/CN9/RC1) ; also sheet 4
SDO1: IC10.27(AN8/CVREF/RP18*/PMA2/CN10/RC2) ; also sheet 4
START: IC10.35(TDI/PMA9/RA9) J17.2 R46.1
U1RX: IC10.44(SCL1/RP8*/CN22/PMD4/RB8) ; also sheet 6
U1TX: IC10.43(INT0/RP7*/CN23/PMD5/RB7) ; also sheet 6
Unconnected: IC11.1(TP) IC11.3(NC) IC11.5(TP) IC11.7(VOUT) IC11.8(TRIM) J19.6

### Notes on the sheet
- Microcontrolador maestro

## Library data of the parts
C1 C2 C6 C8 C10-C14 C17-C23 C25-C30 C32-C35 C37 C38 = rcl:C-EU: CAPACITOR, European symbol
C3-C5 C7 C9 C15 C16 C24 C31 C36 = rcl:CPOL-US: POLARIZED CAPACITOR, American symbol
CON1 = connect:DB9F/90
D1-D4 = diode:BYW100: DIODE high-efficiency fast rectifier (ST)
IC1 = v-reg:LM317?*: 500 mA Adjustable Output Positive Voltage Regulator Source: http://www.onsemi.co.jp .. LM317M-D.PDF
IC2 = linear:*317: Positive VOLTAGE REGULATOR
IC3 IC5 = st-microelectronics:L6203: DMOS FULL BRIDGE DRIVER
IC4 IC6 = linear:OPA2*: Dual Operational Amplifier Low Power, Single-Supply, Rail-To-Rail Operational Amplifier Source: http://focus.ti.com/lit/ds/symlink/opa2345.pdf
IC7 = eagle_jbs_lib:MCP32016
IC8 = maxim-10:MAX232*: RS232 TRANSEIVER
IC9 = eagle_jbs_lib:WT11
IC10 = eagle_jbs_lib:DSPIC33FJXXMC804
IC11 = eagle_jbs_lib:ADR443
J1-J5 J12 J13 = con-molex:22-?-04: CONNECTOR wire to board 2.54 mm (.1 inch) pitch header
J6 J7 = con-molex:22-?-03: CONNECTOR wire to board 2.54 mm (.1 inch) pitch header
J8-J11 = con-molex:22-?-09: CONNECTOR wire to board 2.54 mm (.1 inch) pitch header
J14 J15 = con-molex:22-?-05: CONNECTOR wire to board 2.54 mm (.1 inch) pitch header
J16-J18 = con-molex:22-?-02: CONNECTOR wire to board 2.54 mm (.1 inch) pitch header
J19 = con-amp:520470-3: AMP connector
JP1 = jumper:JP2E: JUMPER
JP2 = jumper:JP4Q: JUMPER
LED1-LED4 = led:LED: LED OSRAM: - CHIPLED LG R971, LG N971, LY N971, LG Q971, LY Q971, LO R971, LY R971 LH N974, LH R974 LS Q976, LO Q976, LY Q976 LO Q996 - Hyper CHIPLED LW Q18S LB Q993, LB Q99A, LB R99A - SideLED LS A670, LO A670, LY A670, LG A670, LP A670 LB A673, LV A673, LT A673, LW A673 LH A674 LY A675 LS A676, LA A676, LO A676, LY A676, LW A676 LS A679, LY A679, LG A679 - Hyper Micro SIDELED® LS Y876, LA Y876, LO Y876, LY Y876 LT Y87S - SmartLED LW L88C, LW L88S LB L89C, LB L89S, LG L890 LS L89K, LO L89K, LY L89K LS L896, LA L896, LO L896, LY L896 - TOPLED LS T670, LO T670, LY T670, LG T670, LP T670 LSG T670, LSP T670, LSY T670, LOP T670, LYG T670 LG T671, LOG T671, LSG T671 LB T673, LV T673, LT T673, LW T673 LH T674 LS T676, LA T676, LO T676, LY T676, LB T676, LH T676, LSB T676, LW T676 LB T67C, LV T67C, LT T67C, LS T67K, LO T67K, LY T67K, LW E67C LS E67B, LA E67B, LO E67B, LY E67B, LB E67C, LV E67C, LT E67C LW T67C LS T679, LY T679, LG T679 LS T770, LO T770, LY T770, LG T770, LP T770 LB T773, LV T773, LT T773, LW T773 LH T774 LS E675, LA E675, LY E675, LS T675 LS T776, LA T776, LO T776, LY T776, LB T776 LHGB T686 LT T68C, LB T68C - Hyper Mini TOPLED® LB M676 - Mini TOPLED Santana® LG M470 LS M47K, LO M47K, LY M47K Source: http://www.osram.convergy.de - LUMILED® LXK2-PW12-R00, LXK2-PW12-S00, LXK2-PW14-U00, LXK2-PW14-V00 LXK2-PM12-R00, LXK2-PM12-S00, LXK2-PM14-U00 LXK2-PE12-Q00, LXK2-PE12-R00, LXK2-PE12-S00, LXK2-PE14-T00, LXK2-PE14-U00 LXK2-PB12-K00, LXK2-PB12-L00, LXK2-PB12-M00, LXK2-PB14-N00, LXK2-PB14-P00, LXK2-PB14-Q00 LXK2-PR12-L00, LXK2-PR12-M00, LXK2-PR14-Q00, LXK2-PR14-R00 LXK2-PD12-Q00, LXK2-PD12-R00, LXK2-PD12-S00 LXK2-PH12-R00, LXK2-PH12-S00 LXK2-PL12-P00, LXK2-PL12-Q00, LXK2-PL12-R00 Source: www.luxeon.com
Q1 = crystal:CRYSTAL: CRYSTAL
R1-R7 R9-R11 R14-R20 R23-R47 = rcl:R-US_: RESISTOR, American symbol
R8 = rcl:R-TRIMM: Trimm resistor
S1 = switch-misc:DT: ITT SWITCH
X1-X8 = con-wago-508:W237-02P: WAGO SREW CLAMP